# Altium schematic sheet Probe4RackV1.1.SchDoc: Projekt
size A4; DrawnBy: Mag. Gerhard Hendl; Organization: Institut for Quantenoptic und Quanteninfromation
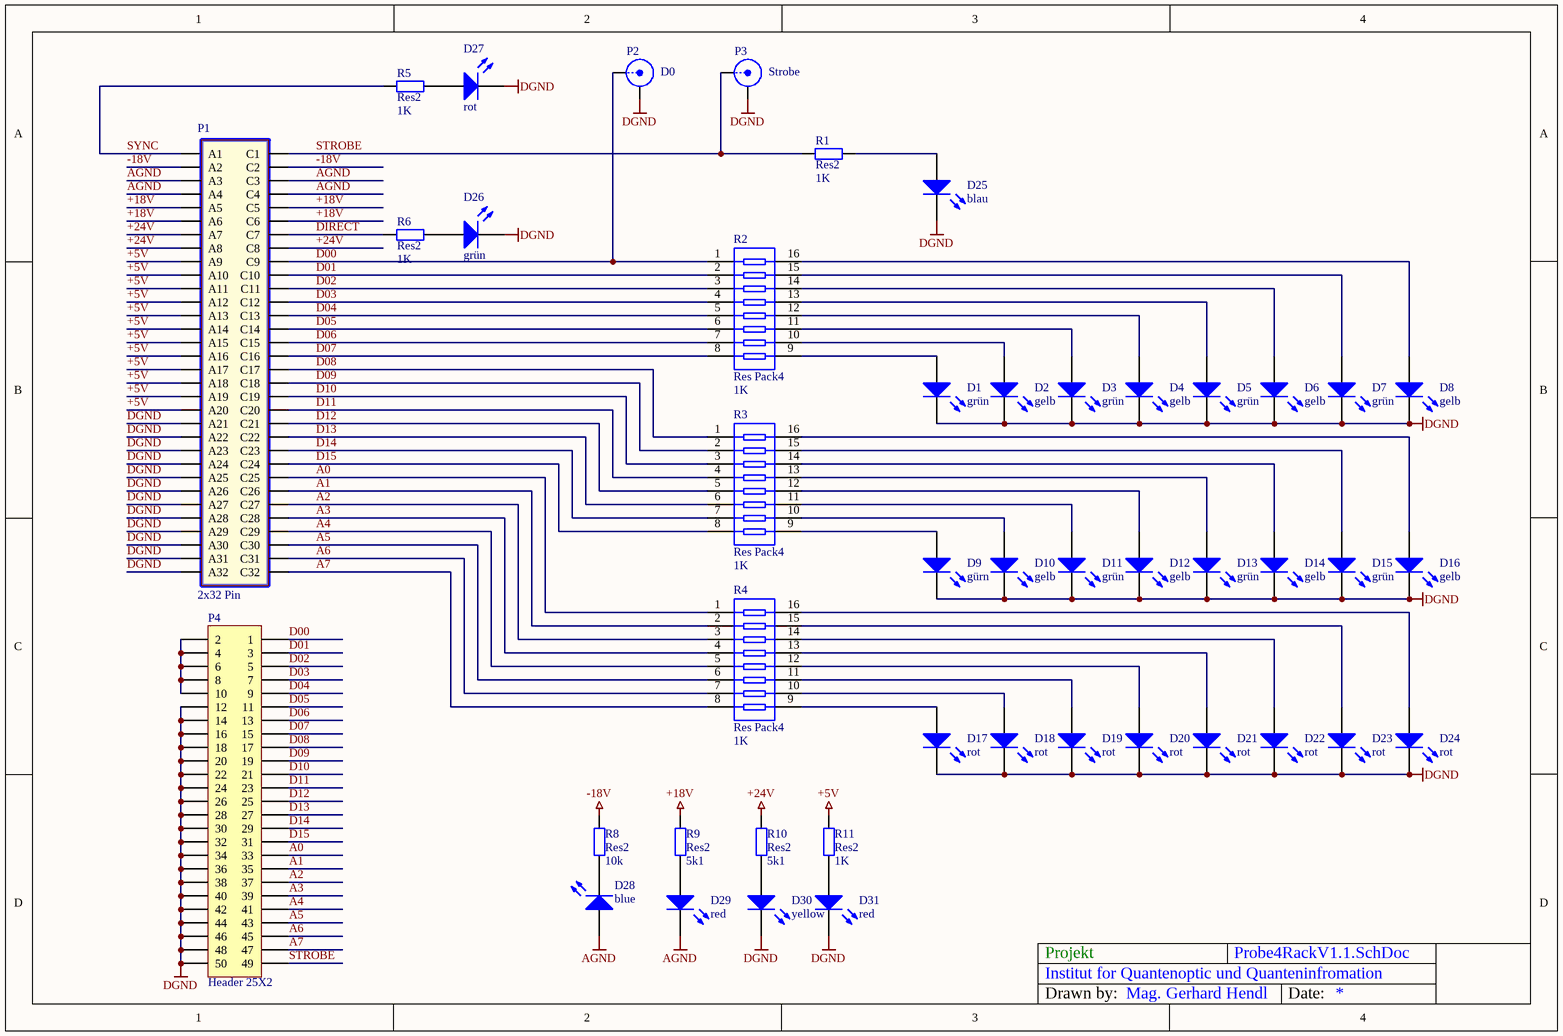
[diagram p0: Probe4RackV1.1.SchDoc]

## Parts
D1  grün  [3.2X1.6X1.1]
D2  gelb  [3.2X1.6X1.1]
D3  grün  [3.2X1.6X1.1]
D4  gelb  [3.2X1.6X1.1]
D5  grün  [3.2X1.6X1.1]
D6  gelb  [3.2X1.6X1.1]
D7  grün  [3.2X1.6X1.1]
D8  gelb  [3.2X1.6X1.1]
D9  gürn  [3.2X1.6X1.1]
D10  gelb  [3.2X1.6X1.1]
D11  grün  [3.2X1.6X1.1]
D12  gelb  [3.2X1.6X1.1]
D13  grün  [3.2X1.6X1.1]
D14  gelb  [3.2X1.6X1.1]
D15  grün  [3.2X1.6X1.1]
D16  gelb  [3.2X1.6X1.1]
D17  rot  [3.2X1.6X1.1]
D18  rot  [3.2X1.6X1.1]
D19  rot  [3.2X1.6X1.1]
D20  rot  [3.2X1.6X1.1]
D21  rot  [3.2X1.6X1.1]
D22  rot  [3.2X1.6X1.1]
D23  rot  [3.2X1.6X1.1]
D24  rot  [3.2X1.6X1.1]
D25  blau  [3.2X1.6X1.1]
D26  grün  [3.2X1.6X1.1]
D27  rot  [3.2X1.6X1.1]
D28  blue  [3.2X1.6X1.1]
D29  red  [3.2X1.6X1.1]
D30  yellow  [3.2X1.6X1.1]
D31  red  [3.2X1.6X1.1]
P1  2x32 Pin  [0903164X919]
P2  D0  [BNC_RA CON]
P3  Strobe  [BNC_RA CON]
P4  Header 25X2  [HDR2X25]
R1  Res2  value 1K  [RESC3216M]
R2  Res Pack4  value 1K  [smd16]
R3  Res Pack4  value 1K  [smd16]
R4  Res Pack4  value 1K  [smd16]
R5  Res2  value 1K  [RESC3216M]
R6  Res2  value 1K  [RESC3216M]
R8  Res2  value 10k  [RESC3216M]
R9  Res2  value 5k1  [RESC3216M]
R10  Res2  value 5k1  [RESC3216M]
R11  Res2  value 1K  [RESC3216M]

## Nets
+5V: P1.A9 P1.A10 P1.A11 P1.A12 P1.A13 P1.A14 P1.A15 P1.A16 P1.A17 P1.A18 P1.A19 P1.A20 R11.1
+18V: P1.A5 P1.A6 P1.C5 P1.C6 R9.1
+24V: P1.A7 P1.A8 P1.C8 R10.1
-18V: P1.A2 P1.C2 R8.1
AGND: D28.1(A) D29.2(K) P1.A3 P1.A4 P1.C3 P1.C4
DGND: D1.2(K) D2.2(K) D3.2(K) D4.2(K) D5.2(K) D6.2(K) D7.2(K) D8.2(K) D9.2(K) D10.2(K) D11.2(K) D12.2(K) D13.2(K) D14.2(K) D15.2(K) D16.2(K) D17.2(K) D18.2(K) D19.2(K) D20.2(K) D21.2(K) D22.2(K) D23.2(K) D24.2(K) D25.2(K) D26.2(K) D27.2(K) D30.2(K) D31.2(K) P1.A21 P1.A22 P1.A23 P1.A24 P1.A25 P1.A26 P1.A27 P1.A28 P1.A29 P1.A30 P1.A31 P1.A32 P2.2(Y) P3.2(Y) P4.12 P4.14 P4.16 P4.18 P4.20 P4.22 P4.24 P4.26 P4.28 P4.30 P4.32 P4.34 P4.36 P4.38 P4.40 P4.42 P4.44 P4.46 P4.48 P4.50
A0: P1.C25 P4.33 R4.1
A1: P1.C26 P4.35 R4.2
A2: P1.C27 P4.37 R4.3
A3: P1.C28 P4.39 R4.4
A4: P1.C29 P4.41 R4.5
A5: P1.C30 P4.43 R4.6
A6: P1.C31 P4.45 R4.7
A7: P1.C32 P4.47 R4.8
D00: P1.C9 P2.1(X) P4.1 R2.1
D01: P1.C10 P4.3 R2.2
D02: P1.C11 P4.5 R2.3
D03: P1.C12 P4.7 R2.4
D04: P1.C13 P4.9 R2.5
D05: P1.C14 P4.11 R2.6
D06: P1.C15 P4.13 R2.7
D07: P1.C16 P4.15 R2.8
D08: P1.C17 P4.17 R3.1
D09: P1.C18 P4.19 R3.2
D10: P1.C19 P4.21 R3.3
D11: P1.C20 P4.23 R3.4
D12: P1.C21 P4.25 R3.5
D13: P1.C22 P4.27 R3.6
D14: P1.C23 P4.29 R3.7
D15: P1.C24 P4.31 R3.8
DIRECT: P1.C7 R6.1
STROBE: P1.C1 P3.1(X) P4.49 R1.1
SYNC: P1.A1 R5.2
NetD1_1: D1.1(A) R2.9
NetD2_1: D2.1(A) R2.10
NetD3_1: D3.1(A) R2.11
NetD4_1: D4.1(A) R2.12
NetD5_1: D5.1(A) R2.13
NetD6_1: D6.1(A) R2.14
NetD7_1: D7.1(A) R2.15
NetD8_1: D8.1(A) R2.16
NetD9_1: D9.1(A) R3.9
NetD10_1: D10.1(A) R3.10
NetD11_1: D11.1(A) R3.11
NetD12_1: D12.1(A) R3.12
NetD13_1: D13.1(A) R3.13
NetD14_1: D14.1(A) R3.14
NetD15_1: D15.1(A) R3.15
NetD16_1: D16.1(A) R3.16
NetD17_1: D17.1(A) R4.9
NetD18_1: D18.1(A) R4.10
NetD19_1: D19.1(A) R4.11
NetD20_1: D20.1(A) R4.12
NetD21_1: D21.1(A) R4.13
NetD22_1: D22.1(A) R4.14
NetD23_1: D23.1(A) R4.15
NetD24_1: D24.1(A) R4.16
NetD25_1: D25.1(A) R1.2
NetD26_1: D26.1(A) R6.2
NetD27_1: D27.1(A) R5.1
NetD28_2: D28.2(K) R8.2
NetD29_1: D29.1(A) R9.2
NetD30_1: D30.1(A) R10.2
NetD31_1: D31.1(A) R11.2
NetP4_2: P4.2 P4.4 P4.6 P4.8 P4.10

## Notes on the sheet
- Drawn by:
- Date:

## Library data of the parts
D1-D31 = LED3: Typical BLUE SiC LED; Published: 8-Jun-2000; LatestRevisionDate: 17-Dec-2003; LatestRevisionNote: PCB Footprint replaced.; DatasheetVersion: 16-Apr-2002; PackageVersion: 16-Apr-2002; PackageReference: 3.5X2.8X1.9; Publisher: Altium Limited
P1 = 64 Pin Header: DIN 41612
P2 P3 = BNC: BNC Elbow Connector; LatestRevisionDate: 17-Jul-2002; LatestRevisionNote: Re-released for DXP Platform.; Publisher: Altium Limited
P4 = Header 25X2: Header, 25-Pin, Dual row; LatestRevisionDate: 17-Jul-2002; LatestRevisionNote: Re-released for DXP Platform.; Publisher: Altium Limited
R1 R5 R6 R8-R11 = Res2: Resistor; Published: 8-Jun-2000; LatestRevisionDate: 17-Jul-2002; LatestRevisionNote: Re-released for DXP Platform.; PackageReference: AXIAL-0.4; Publisher: Altium Limited
R2-R4 = Res Pack4: Isolated Resistor Network; Published: 24-Mar-1999; LatestRevisionDate: 29-May-2009; LatestRevisionNote: IPC-7351 Footprint Added.; PackageVersion: Oct-2003; PackageReference: SSOP16; Publisher: Altium Limited; PackageDescription: 16-Pin Plastic Small Outline Package 0.65 mm Pitch; Code_JEDEC: MO-150-AC; Code_IPC: SOP65P780-16